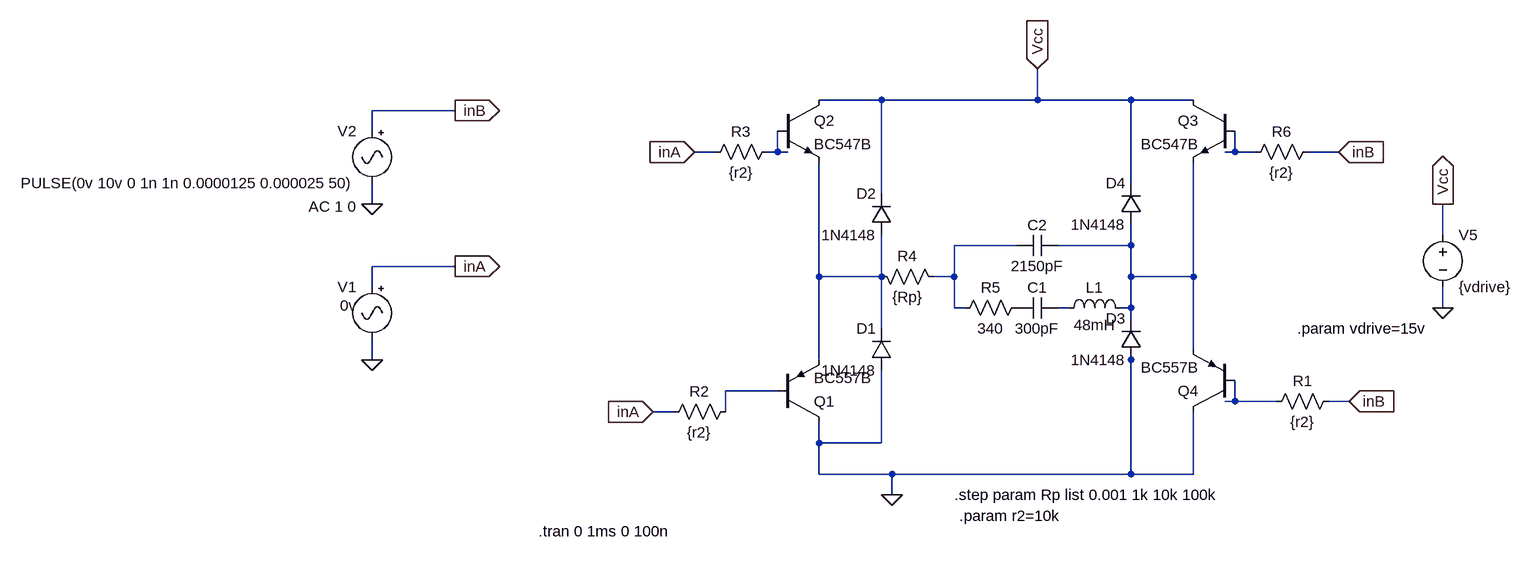
[diagram p0: schematic h-bridge.asc]
h-bridge.asc, the LTspice schematic file:
Version 4
SHEET 1 1760 680
WIRE 304 -48 208 -48
WIRE 544 -48 544 -96
WIRE 544 -48 304 -48
WIRE 688 -48 544 -48
WIRE 784 -48 688 -48
WIRE -352 -32 -480 -32
WIRE -480 0 -480 -32
WIRE 48 32 16 32
WIRE 144 32 144 0
WIRE 144 32 128 32
WIRE 160 32 144 32
WIRE 848 32 848 0
WIRE 848 32 832 32
WIRE 880 32 848 32
WIRE 1008 32 960 32
WIRE 688 80 688 -48
WIRE 304 96 304 -48
WIRE -480 112 -480 80
WIRE 1168 160 1168 112
WIRE 512 176 416 176
WIRE 688 176 688 144
WIRE 688 176 576 176
WIRE -352 208 -480 208
WIRE 208 224 208 48
WIRE 304 224 304 160
WIRE 304 224 208 224
WIRE 416 224 416 176
WIRE 416 224 384 224
WIRE 688 224 688 176
WIRE 784 224 784 48
WIRE 784 224 688 224
WIRE -480 240 -480 208
WIRE 416 272 416 224
WIRE 432 272 416 272
WIRE 592 272 576 272
WIRE 688 272 688 224
WIRE 688 272 672 272
WIRE 1168 272 1168 240
WIRE 688 288 688 272
WIRE 304 304 304 224
WIRE 784 336 784 224
WIRE -480 352 -480 320
WIRE 208 352 208 224
WIRE 688 352 688 336
WIRE 144 400 64 400
WIRE 848 416 848 384
WIRE 848 416 832 416
WIRE 912 416 848 416
WIRE 1024 416 992 416
WIRE -16 432 -48 432
WIRE 64 432 64 400
WIRE 208 480 208 448
WIRE 304 480 304 368
WIRE 304 480 208 480
WIRE 208 528 208 480
WIRE 320 528 208 528
WIRE 688 528 688 352
WIRE 688 528 320 528
WIRE 784 528 784 432
WIRE 784 528 688 528
WIRE 320 560 320 528
FLAG 320 560 0
FLAG 1168 272 0
FLAG 1168 112 Vcc
IOPIN 1168 112 Out
FLAG 544 -96 Vcc
IOPIN 544 -96 In
FLAG -48 432 inA
IOPIN -48 432 In
FLAG 16 32 inA
IOPIN 16 32 In
FLAG -480 352 0
FLAG -352 208 inA
IOPIN -352 208 Out
FLAG -480 112 0
FLAG -352 -32 inB
IOPIN -352 -32 Out
FLAG 1024 416 inB
IOPIN 1024 416 In
FLAG 1008 32 inB
IOPIN 1008 32 In
SYMBOL cap 512 256 M90
WINDOW 0 0 32 VBottom 2
WINDOW 3 32 32 VTop 2
SYMATTR InstName C1
SYMATTR Value 300pF
SYMBOL cap 512 192 R270
WINDOW 0 32 32 VTop 2
WINDOW 3 0 32 VBottom 2
SYMATTR InstName C2
SYMATTR Value 2150pF
SYMBOL ind 576 288 R270
WINDOW 0 32 56 VTop 2
WINDOW 3 5 56 VBottom 2
SYMATTR InstName L1
SYMATTR Value 48mH
SYMBOL res 416 288 R270
WINDOW 0 32 56 VTop 2
WINDOW 3 0 56 VBottom 2
SYMATTR InstName R5
SYMATTR Value 340
SYMBOL diode 320 368 R180
WINDOW 0 24 64 Left 2
WINDOW 3 24 0 Left 2
SYMATTR InstName D1
SYMATTR Value 1N4148
SYMBOL diode 320 160 R180
WINDOW 0 24 64 Left 2
WINDOW 3 24 0 Left 2
SYMATTR InstName D2
SYMATTR Value 1N4148
SYMBOL diode 704 352 R180
WINDOW 0 24 64 Left 2
WINDOW 3 24 0 Left 2
SYMATTR InstName D3
SYMATTR Value 1N4148
SYMBOL diode 704 144 R180
WINDOW 0 24 64 Left 2
WINDOW 3 24 0 Left 2
SYMATTR InstName D4
SYMATTR Value 1N4148
SYMBOL voltage 1168 144 R0
WINDOW 123 0 0 Left 2
WINDOW 39 0 0 Left 2
SYMATTR InstName V5
SYMATTR Value {vdrive}
SYMBOL Misc\\signal -480 224 M0
WINDOW 123 0 0 Left 2
WINDOW 39 0 0 Left 2
WINDOW 3 24 44 Left 2
SYMATTR Value 0v
SYMATTR InstName V1
SYMBOL Misc\\signal -480 -16 M0
WINDOW 123 24 132 Left 2
WINDOW 39 0 0 Left 2
SYMATTR Value2 AC 1 0
SYMATTR InstName V2
SYMATTR Value PULSE(0v 10v 0 1n 1n 0.0000125 0.000025 50)
SYMBOL res 864 48 R270
WINDOW 0 32 56 VTop 2
WINDOW 3 0 56 VBottom 2
SYMATTR InstName R6
SYMATTR Value {r2}
SYMBOL pnp 848 432 R180
SYMATTR InstName Q4
SYMATTR Value BC557B
SYMBOL npn 144 -48 R0
SYMATTR InstName Q2
SYMATTR Value BC547B
SYMBOL npn 848 -48 M0
SYMATTR InstName Q3
SYMATTR Value BC547B
SYMBOL res 896 432 R270
WINDOW 0 32 56 VTop 2
WINDOW 3 0 56 VBottom 2
SYMATTR InstName R1
SYMATTR Value {r2}
SYMBOL res -32 448 R270
WINDOW 0 32 56 VTop 2
WINDOW 3 0 56 VBottom 2
SYMATTR InstName R2
SYMATTR Value {r2}
SYMBOL res 32 48 R270
WINDOW 0 32 56 VTop 2
WINDOW 3 0 56 VBottom 2
SYMATTR InstName R3
SYMATTR Value {r2}
SYMBOL pnp 144 448 M180
SYMATTR InstName Q1
SYMATTR Value BC557B
SYMBOL res 288 208 M90
WINDOW 0 0 56 VBottom 2
WINDOW 3 32 56 VTop 2
SYMATTR InstName R4
SYMATTR Value {Rp}
TEXT -224 616 Left 2 !.tran 0 1ms 0 100n
TEXT 944 304 Left 2 !.param vdrive=15v
TEXT 424 592 Left 2 !.param r2=10k
TEXT 416 560 Left 2 !.step param Rp list 0.001 1k 10k 100k

The netlist it stands for:
* h-bridge.asc
C1 P001 N006 300pF
C2 N003 N004 2150pF
L1 N006 N004 48mH
R5 N003 P001 340
D1 0 N005 1N4148
D2 N005 Vcc 1N4148
D3 0 N004 1N4148
D4 N004 Vcc 1N4148
V5 Vcc 0 {vdrive}
V1 inA 0 0v
V2 inB 0 PULSE(0v 10v 0 1n 1n 0.0000125 0.000025 50) AC 1 0
R6 N002 inB {r2}
Q4 0 N008 N004 0 BC557B
Q2 Vcc N001 N005 0 BC547B
Q3 Vcc N002 N004 0 BC547B
R1 N008 inB {r2}
R2 inA N007 {r2}
R3 inA N001 {r2}
Q1 0 N007 N005 0 BC557B
R4 N005 N003 {Rp}
.model D D
.lib standard.dio
.model NPN NPN
.model PNP PNP
.lib standard.bjt
.tran 0 1ms 0 100n
.param vdrive=15v
.param r2=10k
.step param Rp list 0.001 1k 10k 100k
.backanno
.end